# Altium schematic sheet Buffer_Section.SchDoc
size A3
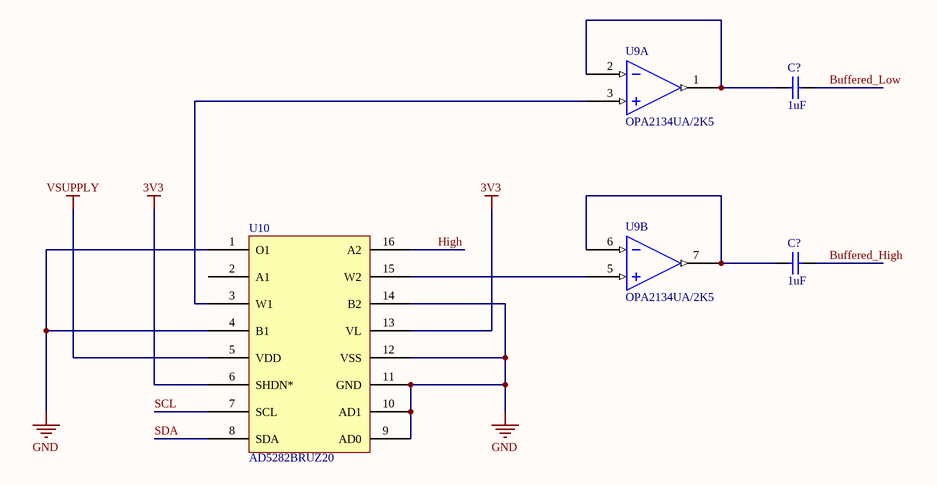
[diagram p0: Buffer_Section.SchDoc]

## Parts
(Parts that share a designator on the sheet are numbered #1, #2 ... from top to bottom, then left to right.)
C?#1  1uF  [CAP Radial 5mm]
C?#2  1uF  [CAP Radial 5mm]
U9  OPA2134UA/2K5  [SOIC127P600X175-8N]  (parts A,B of 2)
U10  AD5282BRUZ20  [TSSOP-16]

## Nets
3V3: U10.6(SHDN*) U10.13(VL)
GND: U10.1(O1) U10.4(B1) U10.9(AD0) U10.10(AD1) U10.11(GND) U10.12(VSS) U10.14(B2)
VSUPPLY: U9.4(V-) U9.8(V+) U10.5(VDD)
Buffered_High: C?#2.2
Buffered_Low: C?#1.2
High: U10.16(A2)
SCL: U10.7(SCL)
SDA: U10.8(SDA)
NetC?#1_1: C?#1.1 U9.1(Out_A) U9.2(-In_A)
NetC?#2_1: C?#2.1 U9.6(-In_B) U9.7(Out_B)
NetU9_3: U9.3(+In_A) U10.3(W1)
NetU9_5: U9.5(+In_B) U10.15(W2)

Not connected (* = marked no-connect by the designer): U10 2(A1)

## Library data of the parts
C?#1 C?#2 = CAP 1uF Radial 5mm: Manufacturer: EPCOS (TDK); Manufacturer P/N: B32529C105J; Voltage: 63V; Value: 1uF; Digikey Part Number: 495-1119-ND
U10 = AD5282BRUZ20: Imported; Vendor: Analog Devices Inc; Taps: 256; Resistance (Ohms): 20K; Number of Circuits: 2; Temperature Coefficient: 30 ppm/Â°C Typical; Memory Type: Volatile; Interface: IÂ²C (Device Address); Voltage - Supply: 4.5 V ~ 16.5 V, Â±4.5 V ~ 5.5 V; C: Copyright (C) 2015 Accelerated Designs. All rights reserved; DigiKeyPartNumber: AD5282BRUZ20-ND; Manufacturer_Part_Number: AD5282BRUZ20; Quantity_Available: 1600; DataSheet: http://www.analog.com/static/imported-files/data_sheets/AD5280_5282.pdf; Operating Temperature: -40Â°C ~ 85Â°C; Mounting Type: Surface Mount; Package / Case: 16-TSSOP (0.173", 4.40mm Width); Supplier Device Package: 16-TSSOP; Packaging: Tube; Copyright: Copyright (C) 2015 Accelerated Designs. All rights reserved; RefDes: RefDes; Type: Type; Value: Value